# Altium schematic sheet 2_PowerPerif.SchDoc
size 414 x 293 mm; SheetNumber: 2; SheetTotal: 4
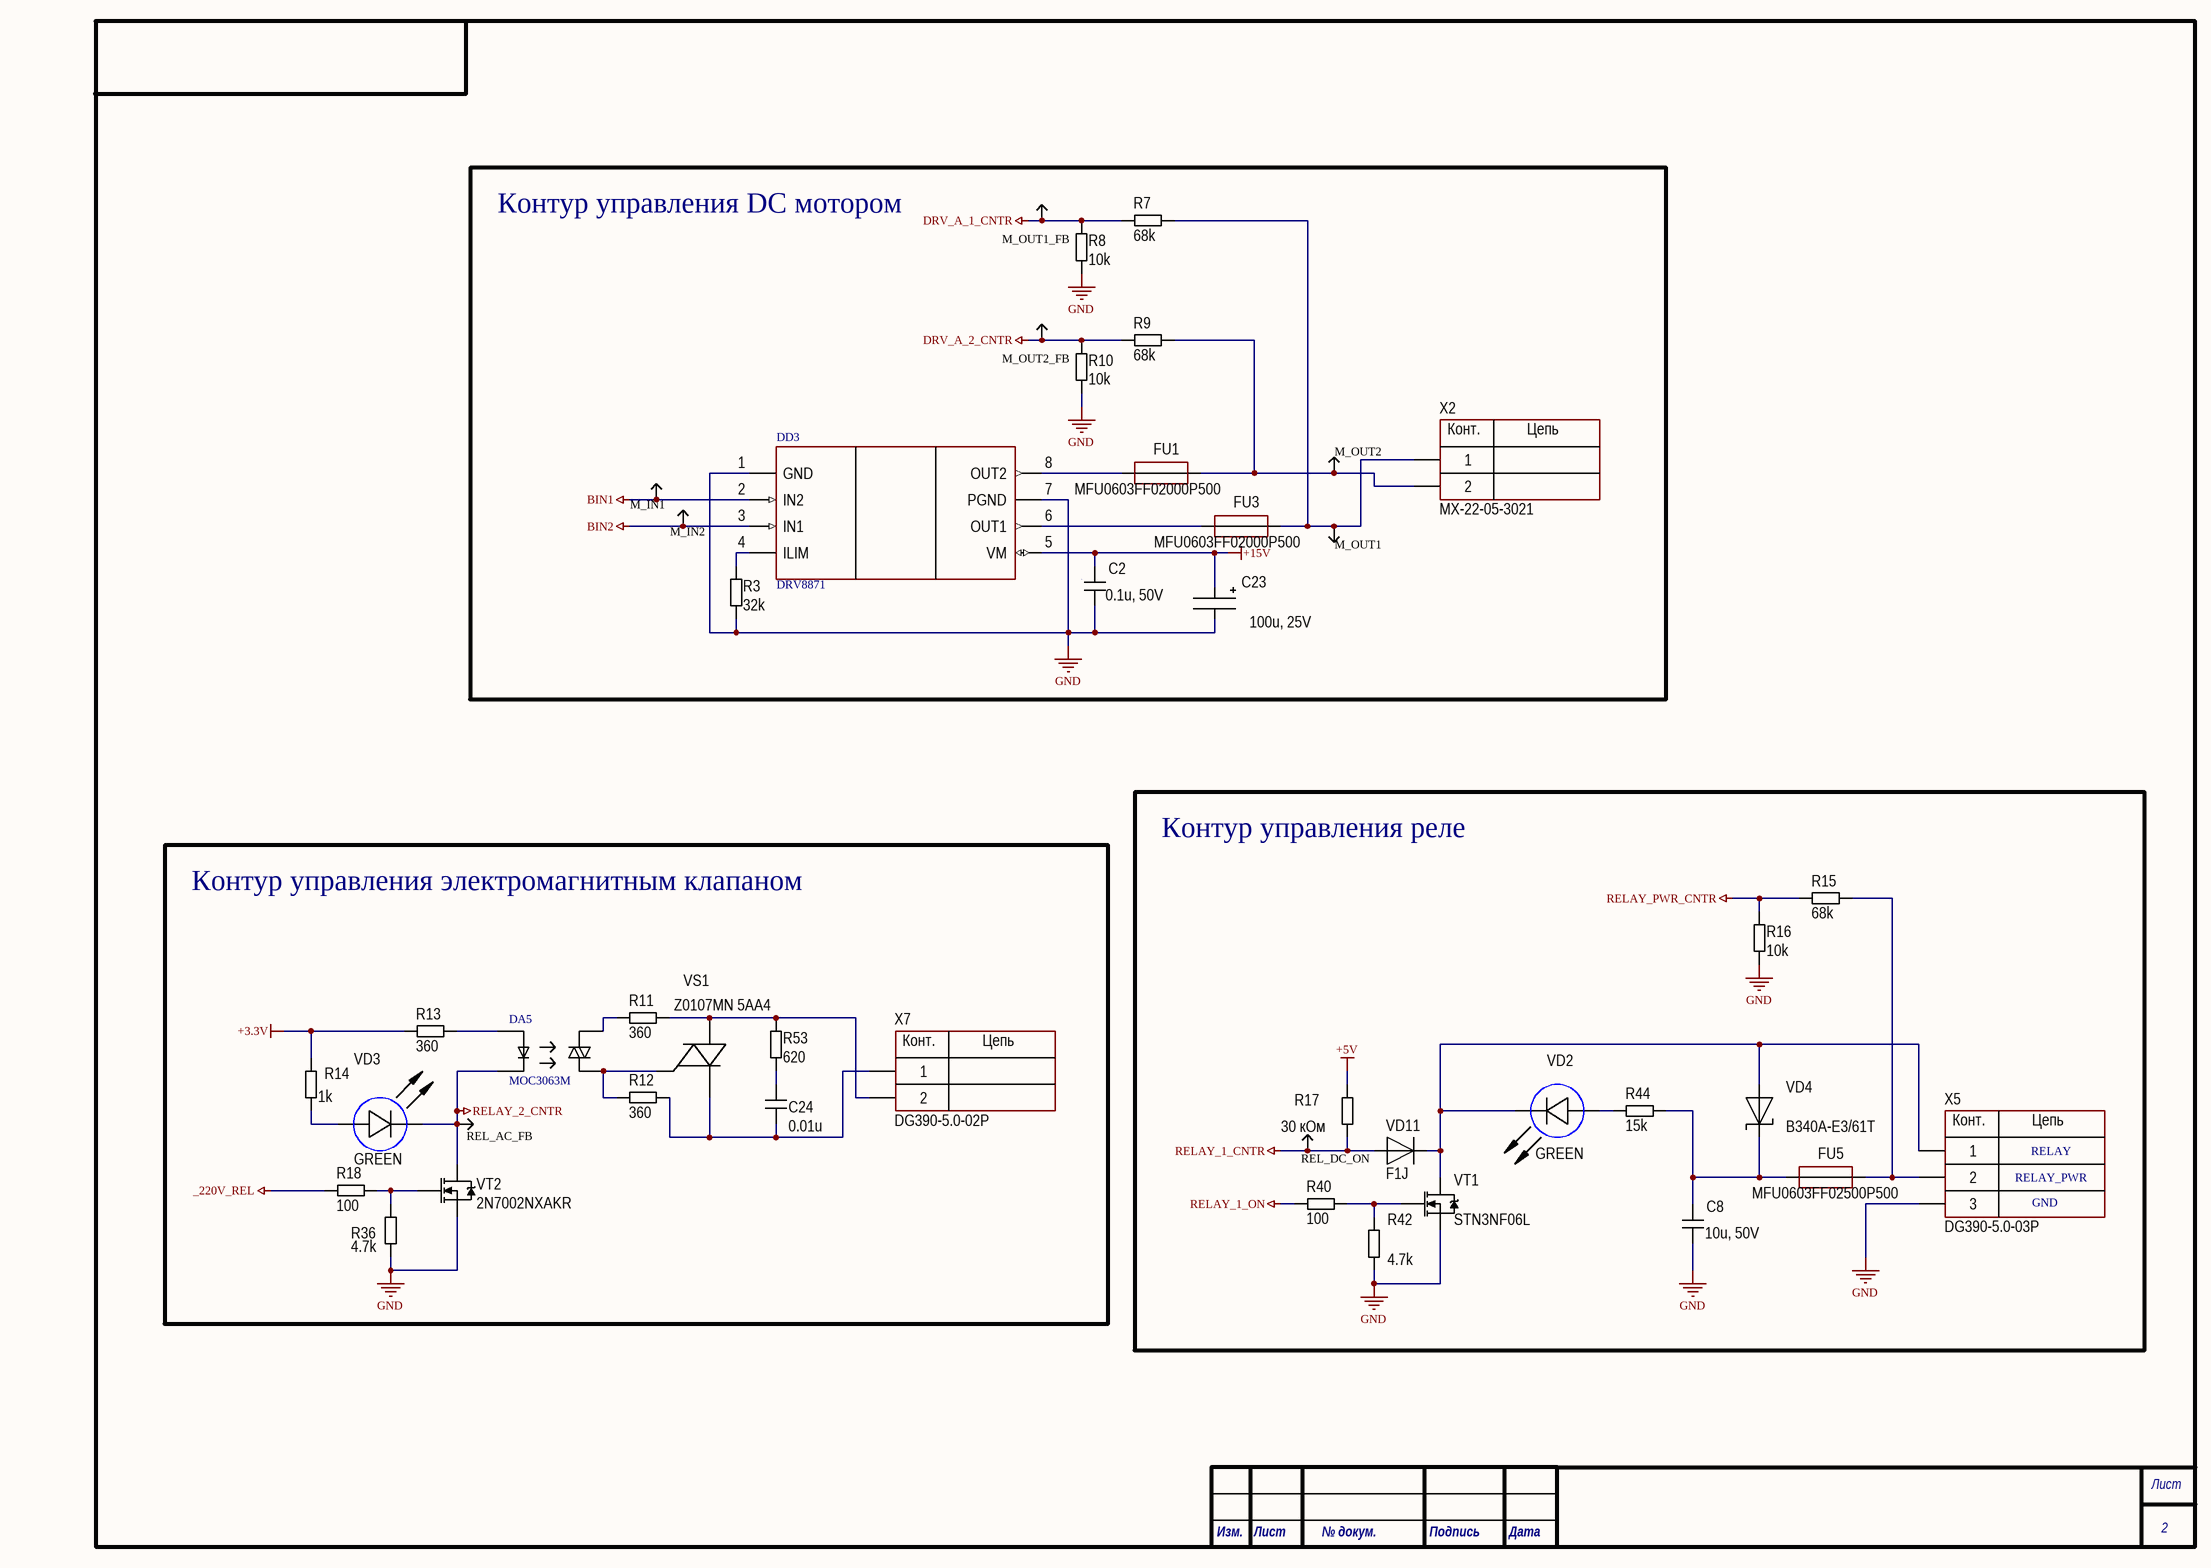
[diagram p0: 2_PowerPerif.SchDoc]

## Parts
C2  0.1u, 50V  [CH0402C]
C8  10u, 50V  [CH1206C]
C23  100u, 25V  [D6.6C6.6H6.1]
C24  0.01u  [CH1210C]
DA5  MOC3063M  [DIP6]
DD3  DRV8871  [8-HSOP]
FU1  MFU0603FF02000P500  [CH0603F]
FU3  MFU0603FF02000P500  [CH0603F]
FU5  MFU0603FF02500P500  [CH0603F]
M_IN1  (no value)  [TestPoint]
M_IN2  (no value)  [TestPoint]
M_OUT1  (no value)  [TestPoint]
M_OUT1_FB  (no value)  [TestPoint]
M_OUT2  (no value)  [TestPoint]
M_OUT2_FB  (no value)  [TestPoint]
R3  32k  [CH0603R]
R7  68k  [CH0402R]
R8  10k  [CH0402R]
R9  68k  [CH0402R]
R10  10k  [CH0402R]
R11  360  [CH2010R]
R12  360  [CH2010R]
R13  360  [CH0805R]
R14  1k  [CH0805R]
R15  68k  [CH0402R]
R16  10k  [CH0402R]
R17  30 кОм  [CH0402R]
R18  100  [CH0805R]
R36  4.7k  [CH0402R]
R40  100  [CH0805R]
R42  4.7k  [CH0402R]
R44  15k  [CH0805R]
R53  620  [CH2010R]
REL_AC_FB  (no value)  [TestPoint]
REL_DC_ON  (no value)  [TestPoint]
VD2  GREEN  [CH0603LB]
VD3  GREEN  [CH0603LB]
VD4  B340A-E3/61T  [SMA]
VD11  F1J  [SOD123F]
VS1  Z0107MN 5AA4  [SOT223_G-D-S]
VT1  STN3NF06L  [SOT223_G-D-S]
VT2  2N7002NXAKR  [SOT23_123]
X2  MX-22-05-3021  [CON: MX-22-05-3021]
X5  DG390-5.0-03P  [CON: 300-03P-5.0]
X7  DG390-5.0-02P  [CON: 300-02P-5.0]

## Blocks framed on the sheet
Контур управления DC мотором: C2 C23 DD3 FU1 FU3 M_IN1 M_IN2 M_OUT1 M_OUT1_FB M_OUT2 M_OUT2_FB R3 R7-R10 X2
Контур управления реле: C8 FU5 R15-R17 R40 R42 R44 REL_DC_ON VD2 VD4 VD11 VT1 X5
Контур управления электромагнитным клапаном: C24 DA5 R11-R14 R18 R36 R53 REL_AC_FB VD3 VS1 VT2 X7

## Nets
+3.3V: R13.2 R14.2
+5V: R17.2
+15V: C2.2 C23.1 DD3.5(VM)
_220V_REL: R18.2
BIN1: DD3.2(IN2) M_IN1.0
BIN2: DD3.3(IN1) M_IN2.0
DRV_A_1_CNTR: M_OUT1_FB.0 R7.2 R8.2
DRV_A_2_CNTR: M_OUT2_FB.0 R9.2 R10.2
GND: C2.1 C8.1 C23.2 DD3.1(GND) DD3.7(PGND) R3.1 R8.1 R10.1 R16.1 R36.1 R42.1 VT1.3(S) VT2.3(S) X5.3
RELAY_1_CNTR: R17.1 REL_DC_ON.0 VD11.1
RELAY_1_ON: R40.2
RELAY_2_CNTR: DA5.2(Vpr-) REL_AC_FB.0 VD3.2(C) VT2.2(D)
RELAY_PWR_CNTR: R15.2 R16.2
NetC8_2: C8.2 FU5.1 R44.2 VD4.2
NetC24_1: C24.1 R12.1 VS1.1 X7.1
NetC24_2: C24.2 R53.2
NetDA5_1: DA5.1(Vpr+) R13.1
NetDA5_4: DA5.4 R11.2
NetDA5_6: DA5.6 R12.2 VS1.3
NetDD3_4: DD3.4(ILIM) R3.2
NetDD3_6: DD3.6(OUT1) FU3.1
NetDD3_8: DD3.8(OUT2) FU1.1
NetFU1_2: FU1.2 M_OUT2.0 R9.1 X2.2
NetFU3_2: FU3.2 M_OUT1.0 R7.1 X2.1
NetFU5_2: FU5.2 R15.1 X5.2
NetR11_1: R11.1 R53.1 VS1.2 X7.2
NetR14_1: R14.1 VD3.1(A)
NetR18_1: R18.1 R36.2 VT2.1(G)
NetR40_1: R40.1 R42.2 VT1.1(G)
NetR44_1: R44.1 VD2.1(A)
NetVD2_2: VD2.2(C) VD4.1 VD11.2 VT1.2(D) X5.1

## Notes on the sheet
- RELAY
- RELAY_PWR
- GND
- Лист
- Изм.
- № докум.
- Подпись
- Дата
- (in symbol 2-Connector) Конт.; Цепь
- (in symbol 3-Connector) Конт.; Цепь

## Library data of the parts
C2 = Capacitor: Model: 04025C104KAT2A; Manufacturer: *; HelpURL: *; ComponentKind: *; Value: *
C8 = Capacitor: Model: CL31B106KBHNNNE; Manufacturer: *; HelpURL: *; ComponentKind: *; Value: *
C23 = AlumCap: Model: JCK1V101M063077; Value: JCK1V101M063077; Manufacturer: *; HelpURL: *; ComponentKind: *
C24 = Capacitor: Model: GRM32QR73A103KW; Manufacturer: *; HelpURL: *; ComponentKind: *; Value: 0.01u
DA5 = MOC3063: Model: MOC3063M
FU1 FU3 FU5 = Fuse: Manufacturer: *; HelpURL: *; ComponentKind: *; Value: *
  FU1 FU3: Model: MFU0603FF02000P500
  FU5: Model: MFU0603FF02500P500
M_IN1 M_IN2 M_OUT1 M_OUT1_FB M_OUT2 M_OUT2_FB REL_AC_FB REL_DC_ON = TestPoint: Model: DNP
R3 = Resistor: Model: AC0603FR-0732K4L; Manufacturer: *; HelpURL: *; ComponentKind: *; Value: *
R7 R9 R15 = Resistor: Model: AC0402FR-0768KL; Manufacturer: *; HelpURL: *; ComponentKind: *; Value: *
R8 R10 R16 = Resistor: Model: AC0402FR-0710KL; Manufacturer: *; HelpURL: *; ComponentKind: *; Value: *
R11 R12 = Resistor: Model: AC2010FK-07360RL; Value: AC2010FK-07360RL; Manufacturer: *; HelpURL: *; ComponentKind: *
R13 = Resistor: Model: AC0805FR-07360RL; Manufacturer: *; HelpURL: *; ComponentKind: *; Value: *
R14 = Resistor: Model: AC0805FR-071KL; Manufacturer: *; HelpURL: *; ComponentKind: *; Value: *
R17 = Resistor: Model: AC0402FR-0730KL; Value: AC0402FR-0730KL; Manufacturer: *; HelpURL: *; ComponentKind: *
R18 R40 = Resistor: Model: AC0805FR-7W100RL; Manufacturer: *; HelpURL: *; ComponentKind: *; Value: *
R36 R42 = Resistor: Model: AC0402FR-074K7L; Manufacturer: *; HelpURL: *; ComponentKind: *; Value: *
R44 = Resistor: Model: AC0805FR-0715KL; Manufacturer: *; HelpURL: *; ComponentKind: *; Value: *
R53 = Resistor: Model: AC2010FK-07620RL; Value: AC2010FK-07620RL; Manufacturer: *; HelpURL: *; ComponentKind: *
VD2 VD3 = LED_1: Model: B1911NG; Manufacturer: *; HelpURL: *; ComponentKind: *; Value: *
VD4 = Diod Schottky: ComponentKind: *; Manufacturer: *; Model: B340A-E3/61T; HelpURL: *
VD11 = Diod: ComponentKind: *; Manufacturer: *; Model: F1J; HelpURL: *
VS1 = TRIAC: Bipolar; Model: Z0107MN 5AA4; Manufacturer: *; ComponentKind: *; HelpURL: *
VT1 VT2 = N-chanel: Mosfet; Manufacturer: *; ComponentKind: *; HelpURL: *
  VT1: Model: STN3NF06L
  VT2: Model: 2N7002NXAKR
X2 X7 = 2-Connector: Manufacturer: *; HelpURL: *; ComponentKind: *
  X2: Model: MX-22-05-3021
  X7: Model: DG390-5.0-02P
X5 = 3-Connector: Model: DG390-5.0-03P; Manufacturer: *; HelpURL: *; ComponentKind: *
DD3 = DRV8871: Model: DRV8871